# EAGLE design PultPowerCommutation (EAGLE 6.3)
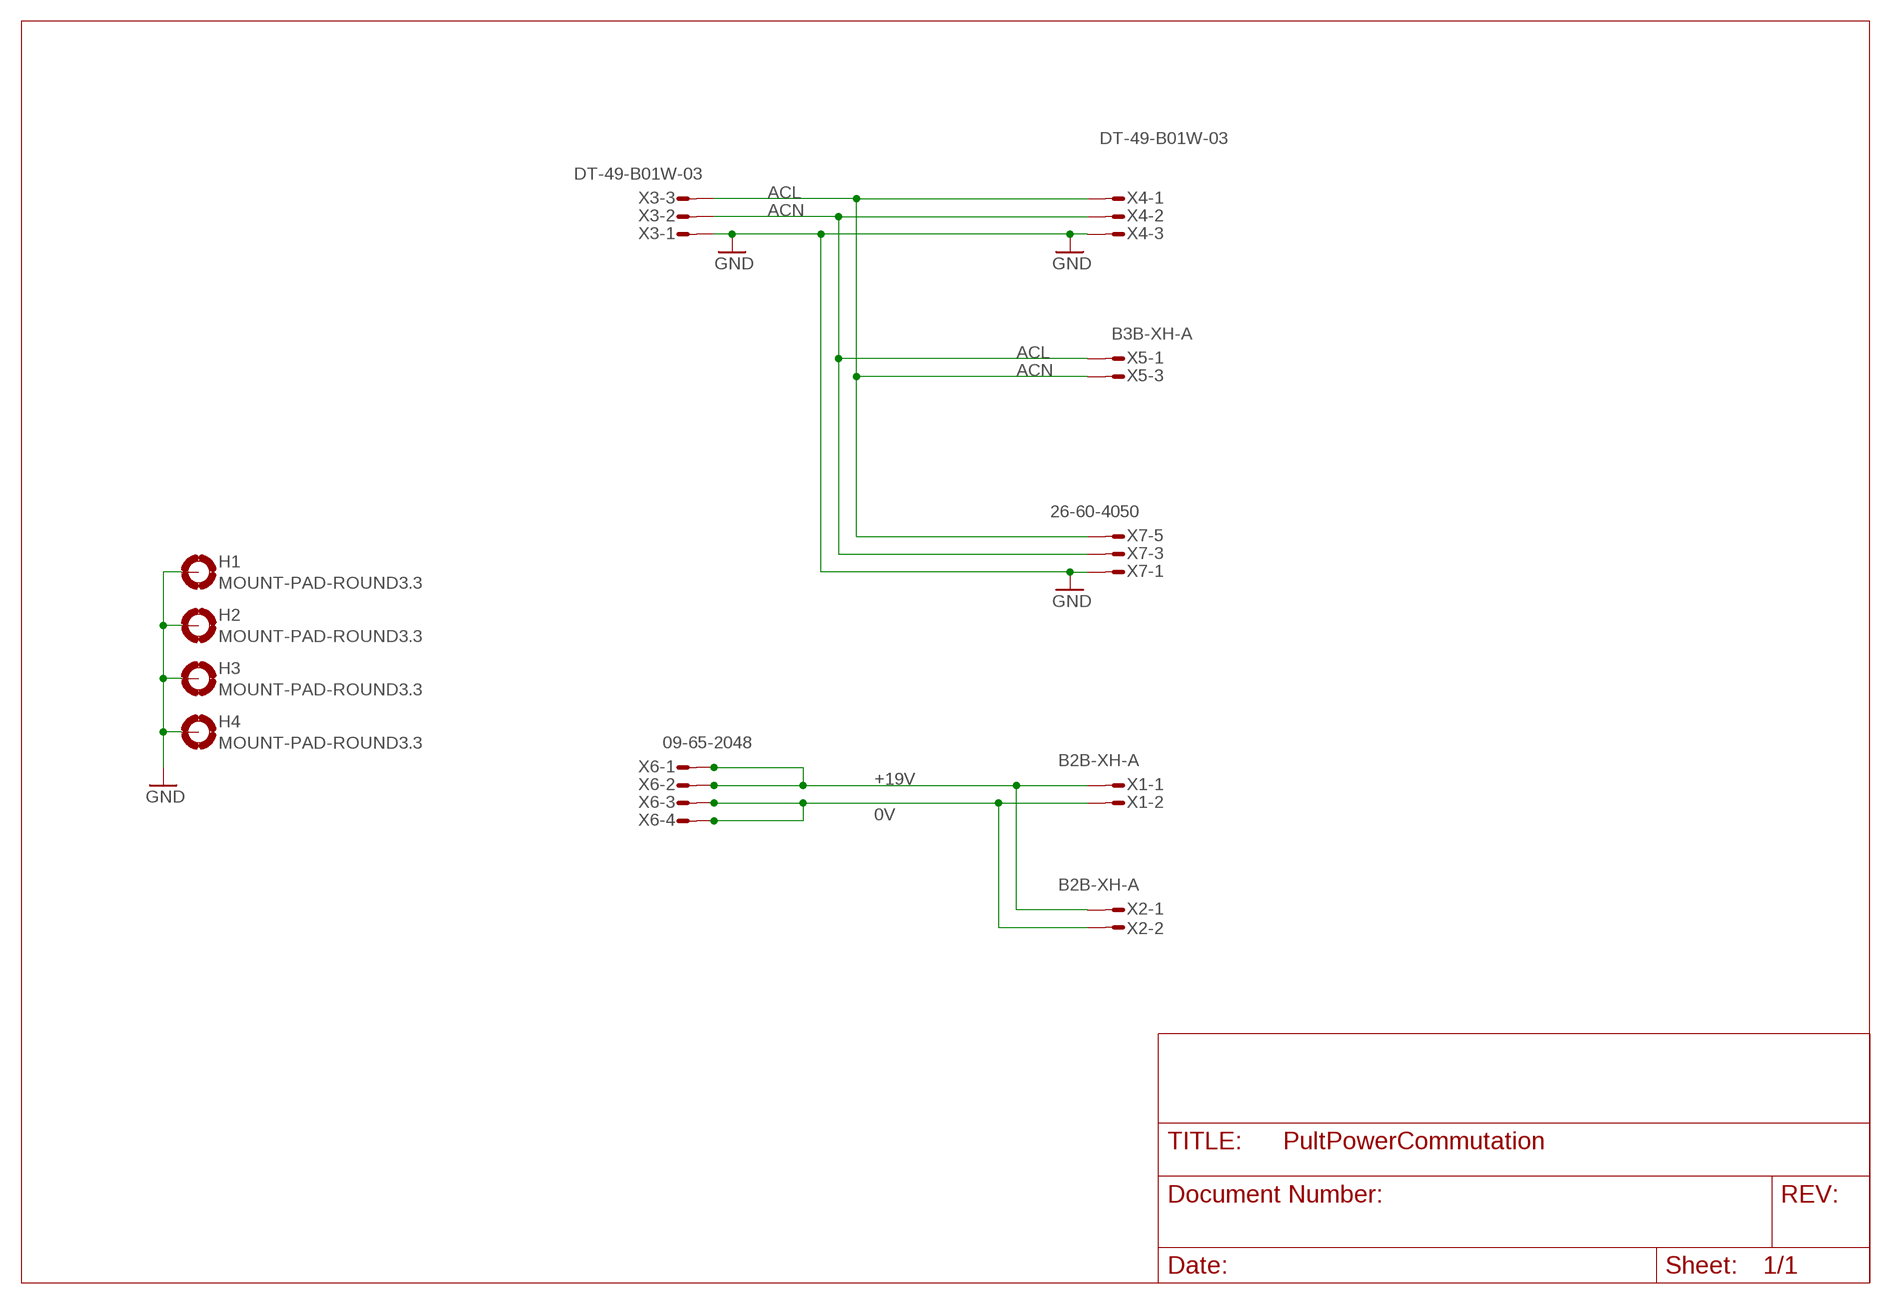
[diagram p0: schematic, sheet 1]

## Parts
H1  MOUNT-PAD-ROUND3.3  [3,3-PAD]
H2  MOUNT-PAD-ROUND3.3  [3,3-PAD]
H3  MOUNT-PAD-ROUND3.3  [3,3-PAD]
H4  MOUNT-PAD-ROUND3.3  [3,3-PAD]
X1  B2B-XH-A  B2B-XH-A(M)  [B2B-XH-AM]
X2  B2B-XH-A  B2B-XH-A(M)  [B2B-XH-AM]
X3  DT-49-B01W-03  DINKLE_DT-49-B01W-03  [DINKLE_DT-49-B01W-03]
X4  DT-49-B01W-03  DINKLE_DT-49-B01W-03  [DINKLE_DT-49-B01W-03]
X5  B3B-XH-A  B3B-XH-A(M)  [B3B-XH-AM]
X6  09-65-2048  MOLEX_09-65-2048  [MOLEX_09-65-2048]
X7  26-60-4050  MOLEX_26-60-4050  [MOLEX_26-60-4050]

## Nets
0V: X1.2 X2.2 X6.3 X6.4
+19V: X1.1 X2.1 X6.1 X6.2
ACL: X3.3 X4.1 X5.3 X7.5
ACN: X3.2 X4.2 X5.1 X7.3
GND: H1.B3,3(MOUNT) H2.B3,3(MOUNT) H3.B3,3(MOUNT) H4.B3,3(MOUNT) X3.1 X4.3 X7.1
Unconnected: X5.2

## Library data of the parts
H1-H4 = holes:MOUNT-PAD-ROUND: MOUNTING PAD, round
X1 X2 = my_components:B2B-XH-A(M): B2B-XH-A(M) Top entry type, 2.5 mm, 2 pin 1 row
X3 X4 = my_components:DINKLE_DT-49-B01W-03: Barrier Style Terminal Blocks Manufacturer: Dinkle Rated voltage: 300V Rated current: 25A(Version B) 10A(Vers. D)
X5 = my_components:B3B-XH-A(M): B3B-XH-A(M) Top entry type, 2.5 mm, 3 pins 1 row
X6 = my_components:MOLEX_09-65-2048: STECKER, 3.96MM KK, 4KONTAKTE
X7 = my_components:MOLEX_26-60-4050: STECKER, 3.96MM KK, 5KONTAKTE (nur 3 von 5 im Einsatz)

## Board
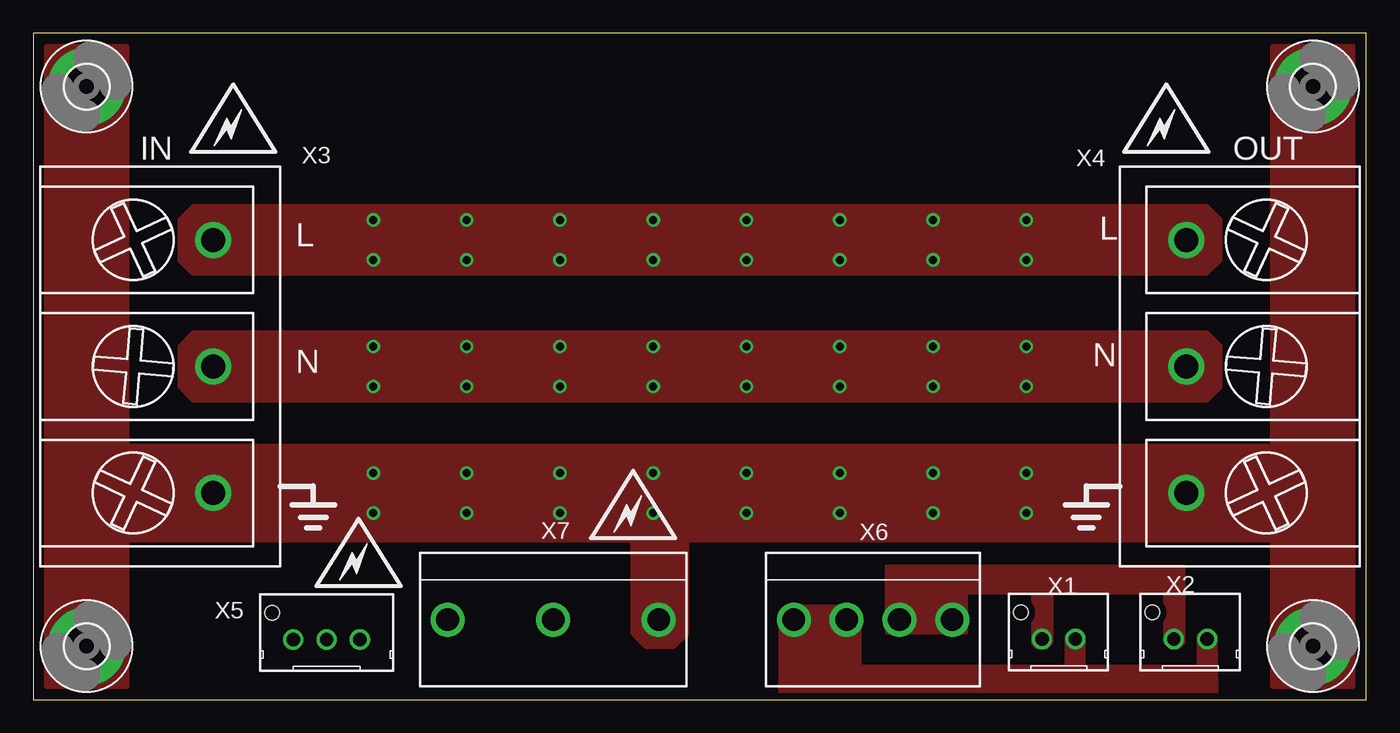
[diagram p1: board, top side]
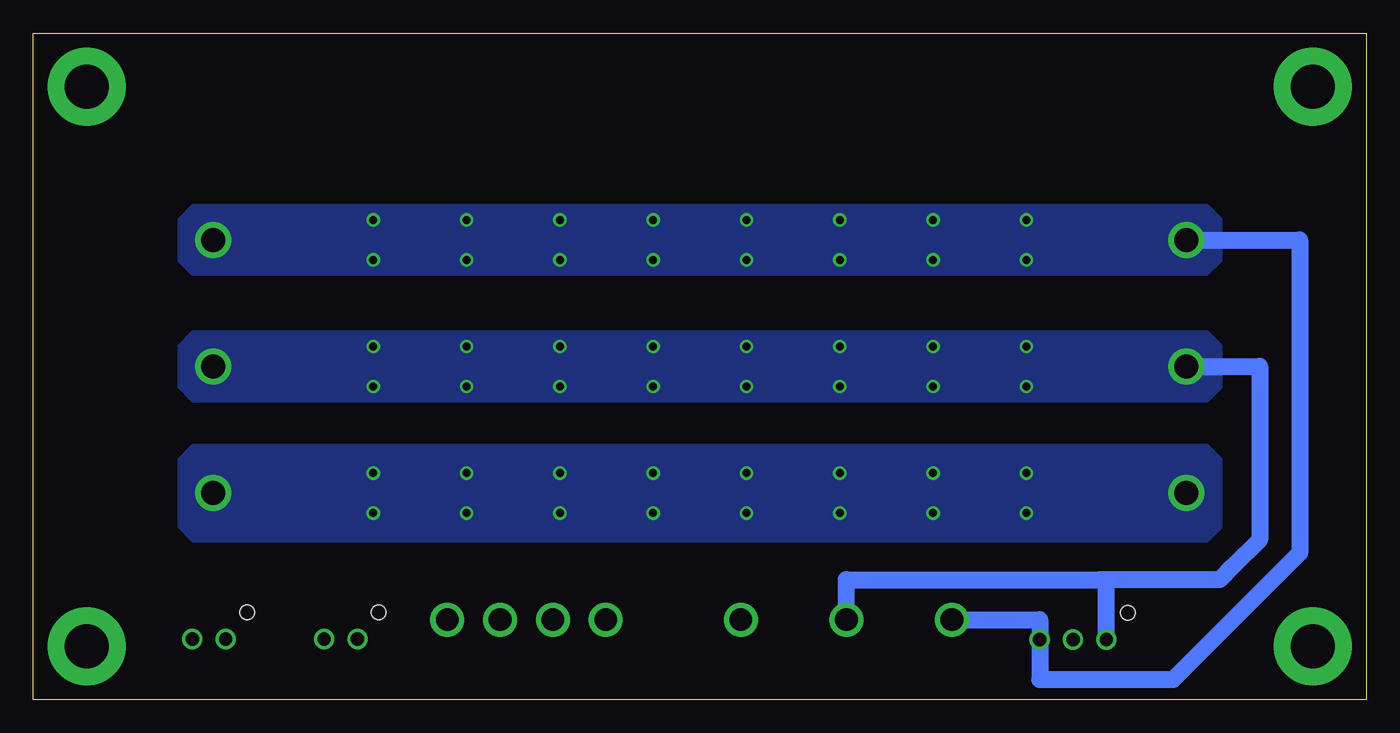
[diagram p2: board, bottom side, seen from below]

Size 100 x 50 mm. Coordinates in mm from the lower left corner, seen from the top.
Outline: 0,0 100,0 100,50 0,50 0,0
Copper layers (1*16): Top 0.035mm / dielectric 1.5mm / Bottom 0.035mm
Design rules "default": minimum track width 10mil, minimum drill 24mil, track to track 0.2mm, track to pad 0.2mm, pad to pad 0.2mm, via to via 0.2mm, smd to smd 0mil, copper to edge 0.5mm, drill to drill 8mil, minimum pad ring 10mil, minimum via ring 0.2mm, stop-mask expansion 4mil, vias tented up to drill 0mil, thermal gap 10mil

### Footprints (pad centres in the part's own frame; a part is rotated, then mirrored left to right if it is on the bottom)
3,3-PAD = drill 3.3 pad 5.842: B3,3 0,0
B2B-XH-AM = drill 1 pad 1.5: 1 -1.25,0; 2 1.25,0 | hole 1.1: -2.85,2; -2.85,2
DINKLE_DT-49-B01W-03 = drill 1.8: 1 -9.5,0; 2 0,0; 3 9.5,0
B3B-XH-AM = drill 1 pad 1.5: 1 -2.5,0; 2 0,0; 3 2.5,0 | hole 1.1: -4.1,2
MOLEX_09-65-2048 = drill 1.7 pad 2.5: 1 -5.94,0; 2 -1.98,0; 3 1.98,0; 4 5.94,0
MOLEX_26-60-4050 = drill 1.7 pad 2.5: 1 -7.92,0; 3 0,0; 5 7.92,0

### Placement (x,y rotation side)
H1  4,4 0 top
H2  96,46 0 top
H3  4,46 0 top
H4  96,4 0 top
U$1  [ICON_BOLT-S]  15,43 0 top
U$2  [ICON_BOLT-S]  85,43 0 top
U$3  [ICON_BOLT-S]  24.4,10.4 0 top
U$4  [ICON_BOLT-S]  45,14 0 top
U$5  [ICON_GND2]  79,13.5 0 top
U$10  [ICON_GND2]  21,13.5 0 top
X1  76.93,4.54 0 top
X2  86.82,4.54 0 top
X3  13.5,25 90 top
X4  86.5,25 270 top
X5  22,4.5 0 top
X6  63,6 180 top
X7  39,6 180 top

### Tracks (layer width: path | path; a pad name or v marks a point on that pad's centre or on a via)
0V
  pour Top (no thermals): 56,6.5 56.5,7 61.5,7 62,6.5 62,2.5 77.5,2.5 77.5,4.8 77.9,5.2 78.4,5.2 78.8,4.8 78.8,2.5 87.4,2.5 87.4,4.8 87.8,5.2 88.3,5.2 88.7,4.8 88.8,0.5 56,0.5
+19V
  pour Top (no thermals): 64,5 64,10 86.3,10 86.3,4.3 85.9,3.9 85.3,3.9 84.9,4.3 84.9,8 76.4,8 76.4,4.3 76,3.9 75.3,3.9 75,4.2 75,8 70,8 70,5
ACL  (via drill 0.6)
  Bottom 1.27: X3.3 5,34.5 5,11 14.5,1.5 24.5,1.5 X5.3 24.5,6 X7.5
  other vias: 25.5,33 25.5,36 32.5,36 32.5,33 39.5,33 39.5,36 46.5,36 46.5,33 53.5,33 53.5,36 60.5,36 60.5,33 67.5,33 67.5,36 74.5,36 74.5,33
  pour Bottom (no thermals): 11,36 12,37 88,37 89,36 89,33 88,32 12,32 11,33
  pour Top (no thermals): 11,36 12,37 88,37 89,36 89,33 88,32 12,32 11,33
ACN  (via drill 0.6)
  Bottom 1.27: X3.2 8,25 8,12 10,10 11,9 19,9 20,9 | X7.3 39,9 20,9 | X5.1 19.5,9 20,9
  other vias: 67.5,23.5 67.5,26.5 74.5,26.5 74.5,23.5 25.5,23.5 25.5,26.5 32.5,26.5 32.5,23.5 39.5,23.5 39.5,26.5 46.5,26.5 46.5,23.5 53.5,23.5 53.5,26.5 60.5,26.5 60.5,23.5
  pour Bottom (no thermals): 11,26.5 12,27.5 88,27.5 89,26.5 89,23.5 88,22.5 12,22.5 11,23.5
  pour Top (no thermals): 12,27.5 88,27.5 89,26.5 89,23.5 88,22.5 12,22.5 11,23.5 11,26.5
GND  (via drill 0.6)
  other vias: 67.5,14 67.5,17 74.5,17 74.5,14 25.5,14 25.5,17 32.5,17 32.5,14 39.5,14 39.5,17 46.5,17 46.5,14 53.5,14 53.5,17 60.5,17 60.5,14
  pour Bottom (no thermals): 11,18 12,19 88,19 89,18 89,13 88,12 12,12 11,13
  pour Top (no thermals): 1,49 7,49 7,19 93,19 93,49 99,49 99,1 93,1 93,12 49,12 49,5 48,4 46,4 45,5 45,12 7,12 7,1 1,1

### Text on the board
tPlace: IN | OUT | L | L | N | N
Reference: Внимание: при монтаже выводных компонентов / методом волновой пайки - наклеить защитную / плёнку в указанных местах.